# EasyEDA Pro project Rocket PCB Final.epro, board HexaFlight V3 PCB
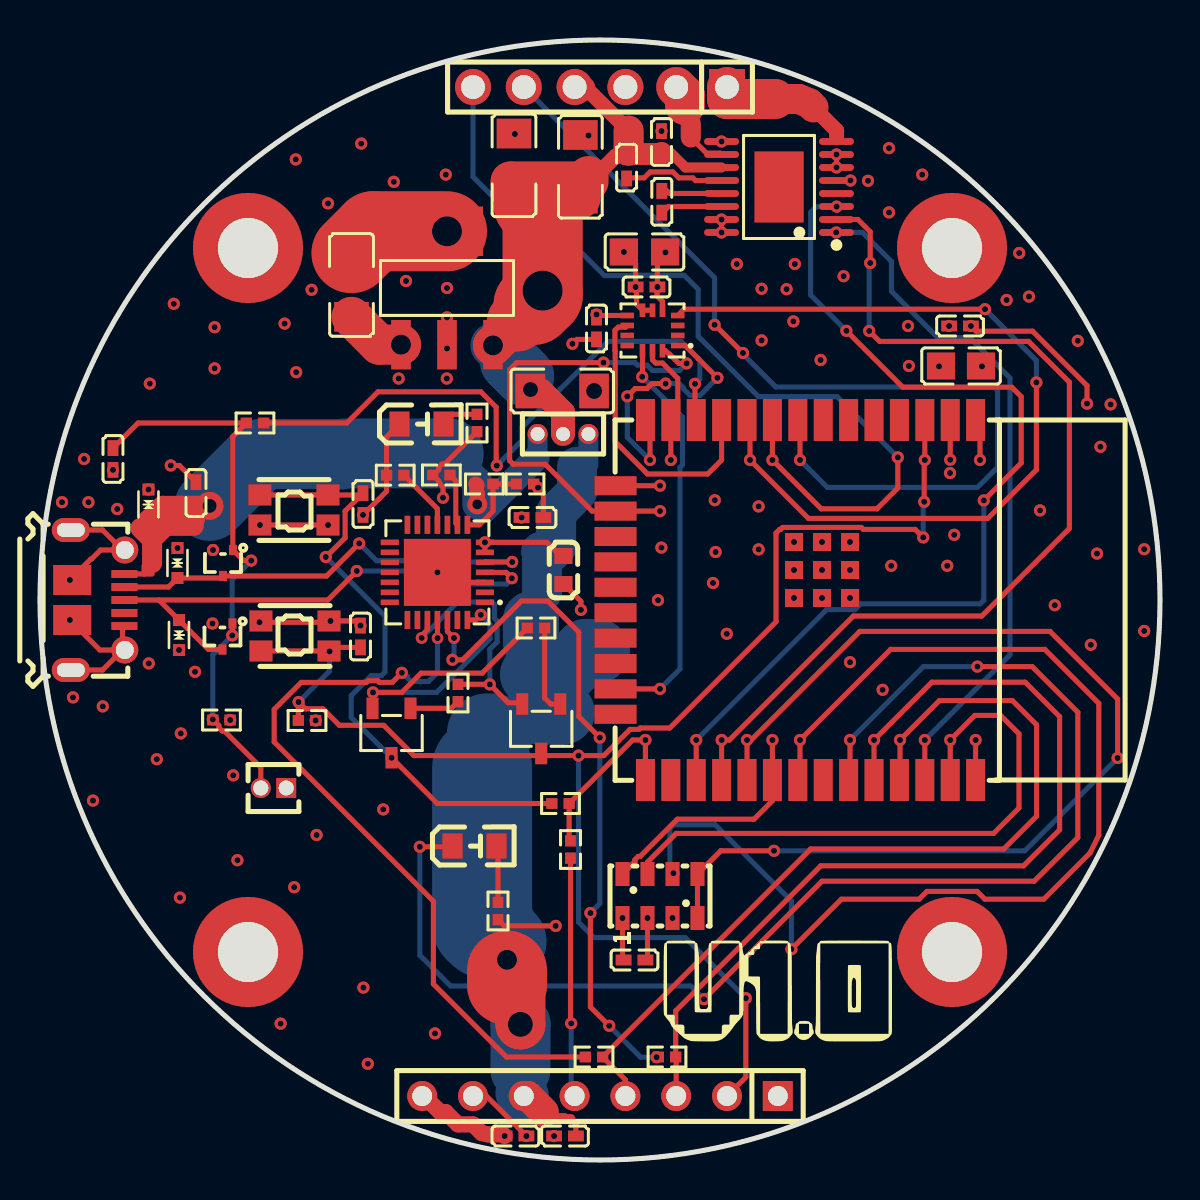
[diagram p1: board, top side]
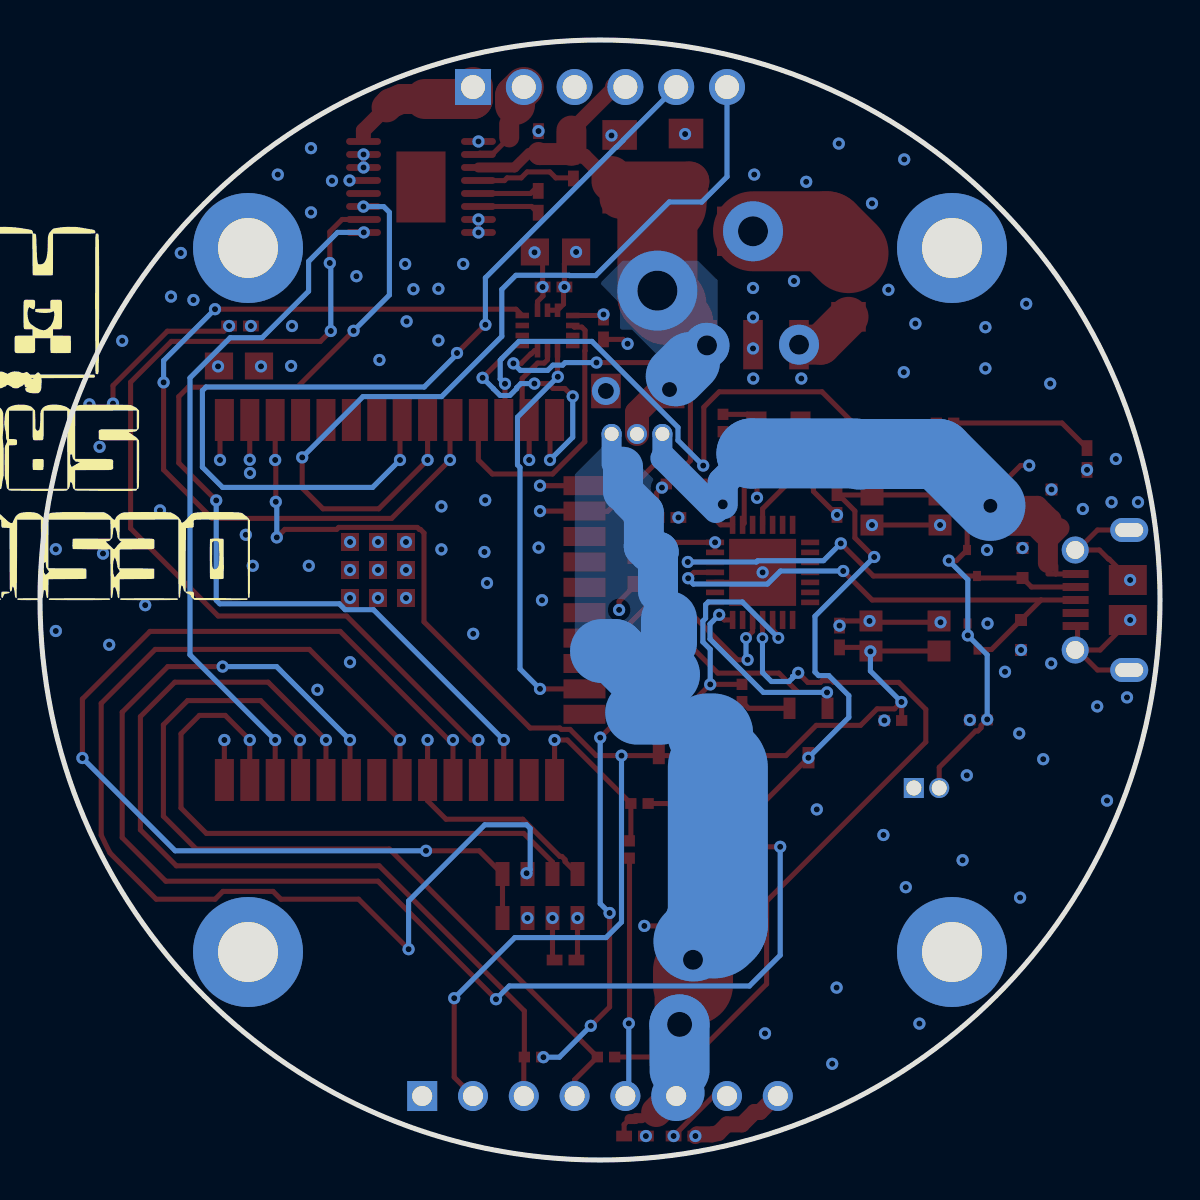
[diagram p2: board, bottom side, seen from below]

Outline 56 x 56 mm; copper layers: Top Layer, Inner1, Inner2, Bottom Layer. Coordinates in mm from the lower left corner of the outline.
Outline path: circle c28,28 r28
Stack: Top Layer 0.035mm Outer layer thickness 1oz / Dielectric1 0.2104mm 7628 RC49% 8.6mil / Inner1 0.0152mm Inner layer thickness / Dielectric2 1.065mm 1.1mm H/HOZ Copper / Inner2 0.0152mm Inner layer thickness / Dielectric3 0.2104mm 7628 RC49% 8.6mil / Bottom Layer 0.035mm Outer layer thickness 1oz

## Design rules (mm)
template: Custom Config
spacing copperThickness1oz (default): track to track 0.102, other pairs 0.152 to 0.3
spacing copperThickness2oz: track to track 0.203, other pairs 0.152 to 0.3
track width copperThickness1oz (default): min 0.1, default 0.254, max 10
track width copperThickness2oz: min 0.203, default 0.254, max 2.54
track width +3V3: min 1, default 1, max 3
track width +5V5 Ext: min 2, default 2, max 3
track width GND: min 1, default 1, max 3
differential pair differentialPair (default): width min 0.127, default 0.254, max 2.54; gap min 0.152, default 0.152
via viaSize (default): diameter min 0.4, default 0.61, max 10; hole min 0.3, default 0.305, max 6.3

## Placement (name value [footprint] x y rotation side)
C1  10uF  [C1206]  26.11 38.45 180 top
C2  10uF  [C1206]  15.57 43.75 90 top
C3  100nF  [C0402]  7.8 33.35 270 top
C4  4.7uF  [C0603]  26.18 29.5 90 top
C5  100nF  [C0402]  24.62 32.12 180 top
C6  100nF  [C0402]  3.65 35.05 90 top
C7  100nF  [C0402]  29.33 49.62 90 top
C8  100nF  [C0402]  23.78 1.2 180 top
C9  100nF  [C0402]  16.02 26.17 270 top
C10  22uF  [C0805#2]  46.05 39.7 180 top
C11  100nF  [C0402]  46 41.7 180 top
C12  100nF  [C0402]  31.07 50.9 270 top
C13  100nF  [C0402]  16.15 32.8 90 top
C14  100nF  [C0402]  26.25 1.2 0 top
C20  10uF  [C1206]  23.7 49.73 270 top
C21  10uF  [C1206]  27.02 49.66 270 top
C23  22nF  [C0402]  31.09 47.91 270 top
C25  100nF  [C0402]  29.72 10 180 top
C26  100nF  [C0402]  30.32 43.65 0 top
D1  LESD5D5.0CT1G  [SOD-523_L1.2-W0.8-LS1.6-BI]  5.42 32.78 270 top
D2  LESD5D5.0CT1G  [SOD-523_L1.2-W0.8-LS1.6-BI]  6.87 29.85 270 top
D3  LESD5D5.0CT1G  [SOD-523_L1.2-W0.8-LS1.6-BI]  6.95 26.25 90 top
H1  Header-Male-2.54_1x6  [HDR-TH_6P-P2.54-V-M-1]  28 53.65 180 top
H3  TJC8-2.54-8A  [HDR-TH_8P-P2.54-V-M-4]  28 3.2 180 top
J3  105017-0001  [MICRO-USB-SMD_105017-0001]  2.89 28 270 top
J4  210-1S-1*3Ppin Gold-plated  [HDR-TH_3P-P1.27-V-M-1]  26.15 36.3 0 top
J5  DZ127R-11-02-25  [HDR-TH_2P-P1.27-V-M]  11.67 18.6 180 top
LED1  0805G (Green)  [LED0805-RD_GREEN]  19.07 36.8 0 top
LED2  FC-2012HRK-620D  [LED0805-RD_RED]  21.72 15.7 0 top
NOREF  -  [Pad_e474]  45.6 10.4 0 top
NOREF#2  -  [Pad_e470]  45.6 45.6 0 top
NOREF#3  -  [Pad_e472]  10.4 45.6 0 top
NOREF#4  -  [Pad_e468]  10.4 10.4 0 top
Q1  2N7002T-7-F  [SOT-523-3_L1.6-W0.8-P1.00-LS1.6-BR]  9.12 26.17 90 top
Q2  SS8050-G  [SOT-23-3_L2.9-W1.6-P1.90-LS2.8-BR]  25.06 21.56 90 top
Q3  2N7002T-7-F  [SOT-523-3_L1.6-W0.8-P1.00-LS1.6-BR]  9.15 29.85 90 top
Q4  SS8050-G  [SOT-23-3_L2.9-W1.6-P1.90-LS2.8-BR]  17.57 21.35 90 top
R1  5.1kΩ  [R0402]  21.85 36.85 270 top
R2  560Ω  [R0402]  22.9 12.45 270 top
R3  1kΩ  [R0402]  20.07 34.25 180 top
R4  0Ω  [R0402]  27.7 5.15 180 top
R5  0Ω  [R0402]  31.35 5.15 180 top
R6  10kΩ  [R0402]  24.8 26.6 0 top
R7  22.1kΩ  [R0402]  22.22 33.8 180 top
R8  10kΩ  [R0402]  17.76 34.24 0 top
R9  1kΩ  [R0402]  10.75 36.85 0 top
R10  10kΩ  [R0402]  20.9 23.35 270 top
R11  10kΩ  [R0402]  9.07 22 180 top
R12  47.5kΩ  [R0402]  24.25 33.8 180 top
R13  10kΩ  [R0402]  13.35 21.97 0 top
R14  22Ω  [R0402]  26.53 15.52 270 top
R15  22Ω  [R0402]  26.03 17.82 180 top
SW3  EVPAA602W  [KEY-TH_4P-L3.5-W4.9-P2.80-LS4.3]  12.75 26.2 180 top
SW4  EVPAA602W  [KEY-TH_4P-L3.5-W4.9-P2.80-LS4.3]  12.7 32.5 0 top
U1  AMS1117-3.3_C347222  [SOT-223-4_L6.5-W3.5-P2.30-LS7.0-BR]  20.35 43.6 270 top
U2  CP2102N-A02-GQFN28R  [QFN-28_L5.0-W5.0-P0.50-TL-EP3.3]  19.87 29.38 180 top
U3  ESP32-WROOM-32E(8MB)  [WIFI-SMD_ESP32-WROOM-32E]  37.78 28 180 top
U9  10nF  [C0402]  27.82 41.58 270 top
U10  2.2uF  [C0805]  30.22 45.4 180 top
U11  MS560702BA03-50  [SENSOR-SMD_MS560702BA03-50]  31 13.2 90 top
U12  ICM-42688-P  [LGA-14_L3.0-W2.5-P0.50-TL]  30.62 41.48 180 top
U13  DRV8874PWPR  [HTSSOP-16_L5.0-W4.4-P0.65-LS6.4-BL-EP]  36.95 48.65 90 top

## Footprints (pads in the part's own frame, mm; a bottom-side part is the same pattern mirrored in y, then rotated)
C0402
  rect 0.79x0.54 smd: 1(-0.545,0) 2(0.545,0)
C0603
  rect 0.8x0.9 smd: 1(-0.7,0) 2(0.7,0)
C0805
  rect 1.41x1.35 smd: 1(-1.03,0) 2(1.03,0)
C0805#2
  rect 1.41x1.35 smd: 1(-1,0) 2(1,0)
C1206
  rect 1.485x1.728 smd: 1(-1.593,0) 2(1.593,0)
HDR-TH_2P-P1.27-V-M
  rect 1x1 hole 0.75: 1(-0.635,0)
  round 1 hole 0.75: 2(0.635,0)
HDR-TH_3P-P1.27-V-M-1
  round 1 hole 0.7: 1(-1.27,0) 2(0,0) 3(1.27,0)
HDR-TH_6P-P2.54-V-M-1
  rect 1.8x1.8 hole 1.2: 1(-6.35,0)
  round 1.8 hole 1.2: 2(-3.81,0) 3(-1.27,0) 4(1.27,0) 5(3.81,0) 6(6.35,0)
HDR-TH_8P-P2.54-V-M-4
  rect 1.5x1.5 hole 1: 1(-8.89,0)
  round 1.5 hole 1: 2(-6.35,0) 3(-3.81,0) 4(-1.27,0) 5(1.27,0) 6(3.81,0) 7(6.35,0) 8(8.89,0)
HTSSOP-16_L5.0-W4.4-P0.65-LS6.4-BL-EP
  oval 0.343x1.746 smd: 1(-2.275,-2.873) 2(-1.625,-2.873) 3(-0.975,-2.873) 4(-0.325,-2.873) 5(0.325,-2.873) 6(0.975,-2.873) 7(1.625,-2.873) 8(2.275,-2.873) 9(2.275,2.873) 10(1.625,2.873) 11(0.975,2.873) 12(0.325,2.873) 13(-0.325,2.873) 14(-0.975,2.873) 15(-1.625,2.873) 16(-2.275,2.873)
  rect 3.55x2.46 smd: 17(0,0)
KEY-TH_4P-L3.5-W4.9-P2.80-LS4.3
  rect 1.15x1.05 smd: 1(-1.702,0.751) 2(1.7,0.75) 3(-1.702,-0.751) 4(1.702,-0.751)
LED0805-RD_GREEN
  rect 1x1.25 smd: 1(-1.1,0) 2(1.1,0)
LED0805-RD_RED
  rect 1x1.25 smd: 1(-1.1,0) 2(1.1,0)
LGA-14_L3.0-W2.5-P0.50-TL
  rect 0.675x0.28 smd: 1(-1.262,0.75) 2(-1.262,0.25) 3(-1.262,-0.25) 4(-1.262,-0.75) 8(1.262,-0.75) 9(1.262,-0.25) 10(1.262,0.25) 11(1.262,0.75)
  rect 0.28x0.675 smd: 5(-0.5,-1.012) 6(0,-1.012) 7(0.5,-1.012) 12(0.5,1.012) 13(0,1.012) 14(-0.5,1.012)
MICRO-USB-SMD_105017-0001
  rect 0.4x1.3 smd: 1(-1.3,1.33) 2(-0.65,1.33) 3(0,1.33) 4(0.65,1.33) 5(1.3,1.33)
  round 1.35 hole 0.9: 6(-2.5,1.35) 7(2.5,1.35)
  oval 1.2x1.9 hole 0.7x1.4: 8(3.5,-1.35) 9(-3.5,-1.35)
  rect 1.5x1.9 smd: 10(-1,-1.28) 10(1,-1.28)
Pad_e468
  round 5.5 hole 3: 1(0,0)
Pad_e470
  round 5.5 hole 3: 1(0,0)
Pad_e472
  round 5.5 hole 3: 1(0,0)
Pad_e474
  round 5.5 hole 3: 1(0,0)
QFN-28_L5.0-W5.0-P0.50-TL-EP3.3
  rect 0.905x0.28 smd: 1(-2.377,1.5) 2(-2.377,1) 3(-2.377,0.5) 4(-2.377,0) 5(-2.377,-0.5) 6(-2.377,-1) 7(-2.377,-1.5) 15(2.377,-1.5) 16(2.377,-1) 17(2.377,-0.5) 18(2.377,0) 19(2.377,0.5) 20(2.377,1) 21(2.377,1.5)
  rect 0.28x0.905 smd: 8(-1.5,-2.377) 9(-1,-2.377) 10(-0.5,-2.377) 11(0,-2.377) 12(0.5,-2.377) 13(1,-2.377) 14(1.5,-2.377) 22(1.5,2.377) 23(1,2.377) 24(0.5,2.377) 25(0,2.377) 26(-0.5,2.377) 27(-1,2.377) 28(-1.5,2.377)
  rect 3.35x3.35 smd: 29(0,0)
R0402
  rect 0.566x0.54 smd: 1(-0.433,0) 2(0.433,0)
SENSOR-SMD_MS560702BA03-50
  rect 1.2x0.7 smd: 1(-1.1,1.875) 2(-1.1,0.625) 3(-1.1,-0.625) 4(-1.1,-1.875) 5(1.1,-1.875) 6(1.1,-0.625) 7(1.1,0.625) 8(1.1,1.875)
SOD-523_L1.2-W0.8-LS1.6-BI
  rect 0.6x0.6 smd: 1(-0.75,0) 2(0.75,0)
SOT-23-3_L2.9-W1.6-P1.90-LS2.8-BR
  rect 1.07x0.6 smd: 1(1.235,-0.95) 2(1.235,0.95) 3(-1.235,0)
SOT-223-4_L6.5-W3.5-P2.30-LS7.0-BR
  rect 2.47x0.98 smd: 1(2.835,-2.3) 2(2.835,0) 3(2.835,2.3)
  rect 2.47x3.6 smd: 4(-2.835,0)
SOT-523-3_L1.6-W0.8-P1.00-LS1.6-BR
  rect 0.51x0.4 smd: 1(0.65,-0.5) 2(0.65,0.5) 3(-0.65,0)
WIFI-SMD_ESP32-WROOM-32E
  rect 0.95x2.1 smd: 1(-9.002,-9) 2(-7.732,-9) 3(-6.463,-9) 4(-5.192,-9) 5(-3.922,-9) 6(-2.652,-9) 7(-1.383,-9) 8(-0.113,-9) 9(1.157,-9) 10(2.428,-9) 11(3.697,-9) 12(4.968,-9) 13(6.237,-9) 14(7.508,-9) 25(7.508,9) 26(6.237,9) 27(4.968,9) 28(3.697,9) 29(2.428,9) 30(1.157,9) 31(-0.113,9) 32(-1.383,9) 33(-2.652,9) 34(-3.922,9) 35(-5.192,9) 36(-6.463,9) 37(-7.732,9) 38(-9.002,9)
  rect 2.1x0.95 smd: 15(9.002,-5.715) 16(9.002,-4.445) 17(9.002,-3.175) 18(9.002,-1.905) 19(9.002,-0.635) 20(9.002,0.635) 21(9.002,1.905) 22(9.002,3.175) 23(9.002,4.445) 24(9.002,5.715)
  rect 0.9x0.9 smd: 39(-2.721,-0.1) 39(-2.721,-1.5) 39(-2.721,-2.9) 39(-1.321,-0.1) 39(-1.321,-1.5) 39(-1.321,-2.9) 39(0.079,-0.1) 39(0.079,-1.5) 39(0.079,-2.9)

## Nets
As in the schematic.

Pads without a net: J3 4; NOREF 1; NOREF#2 1; NOREF#3 1; NOREF#4 1; U2 1 2 10 12 13 14 15 16 17 18 19 20 21 22 23 27; U3 4 5 6 7 17 18 19 20 21 22 24 26 32; U12 2 3 10 11; U13 4

## Via types
v1: diameter 2, hole 1, Top Layer to Bottom Layer, 3 vias
v2: diameter 4, hole 2, Top Layer to Bottom Layer, 1 via
v3: diameter 1.5, hole 0.75, Top Layer to Bottom Layer, 1 via
v4: diameter 0.61, hole 0.305, Top Layer to Bottom Layer, 212 vias
v5: diameter 1.4, hole 0.8, Top Layer to Bottom Layer, 1 via
v6: diameter 3, hole 1.5, Top Layer to Bottom Layer, 1 via
v7: diameter 1, hole 0.5, Top Layer to Bottom Layer, 1 via
v8: diameter 1.4, hole 0.7, Top Layer to Bottom Layer, 1 via
v9: diameter 2.5, hole 1.25, Top Layer to Bottom Layer, 1 via
v10: diameter 0.59, hole 0.305, Top Layer to Bottom Layer, 2 vias
v11: diameter 0.58, hole 0.305, Top Layer to Bottom Layer, 1 via

## Routing (per net, layer and track width the routed paths; a pad name or vN(x,y) marks a point on that pad's centre or on a via; arc(x,y) is an arc through that point)
+3V3: length 31.3
  Top Layer w0.254: 26.18,30.05 25.34,30.88 v4(22.25,30.88) U2.6 ; U12.8 27.88,42.23 v4(27.82,42.28) ; U3.2 v4(45.51,35.01) 45.5,35 ; v4(25.78,11.7) 23.21,11.7 R2.2 ; C25.2 29.12,10.05 v4(29.12,12.1) ; v4(31.27,45.38) 30.87,44.98 v4(30.87,43.65) 30.85,43.63 30.85,43.2 31.12,42.93 U12.5 ; v4(20.15,33.11) 20.15,33.66 19.94,33.86 19.94,33.95 R3.2 19.68,34.25 19.94,34.51 19.94,34.64 20.1,34.8 20.23,34.8 R1.2
  Top Layer w0.8: v4(23.23,1.2) 23.15,1.28 22.41,1.28 arc(22.24,1.31) 22.08,1.35 21.65,1.78 20.9,1.78 20.28,2.4 20,2.4 19.2,3.2 H3.8
  Top Layer w4: C2.2 16.67,46.44 v6(20.35,46.44)
  vias: v4(13.58,43.51) v4(13.78,21.97) v4(14.4,47.83) v4(17.69,48.91) v4(18.3,43.95) v4(20.29,49.27) v4(20.35,43.6) v4(20.35,42.13) v4(20.35,40.58) v4(20.34,39.07) v4(24.08,32.12) v4(40.52,48.98) v4(41.4,48.96) v4(43.4,41.7) v4(43.45,39.7) v4(44.95,39.68) v4(45.46,41.7) v4(45.5,34.35)
+5V: length 31.7
  Top Layer w0.5: 31.54,50.36 32.27,49.63 34.08,49.63
  Top Layer w0.75: 27.79,49.21 28.78,50.2 29.43,50.2 ; H1.4 27.25,53.65 ; 29.25,51.65 27.43,53.47 27.25,53.47
  Top Layer w1: 27.25,53.65 27.25,53.47 ; 29.25,51.47 29.43,51.47
  Top Layer w1.1: 29.43,50.46 29.59,50.3 31.02,50.3 31.07,50.35
  Top Layer w1.2: v3(24.53,38.52) 24.6,38.45 25.07,38.45 26.15,37.38 J4.2
  Top Layer w1.5: 29.43,51.47 29.43,50.46
  Top Layer w2: 27.15,48.92 27.02,48.79 C21.2 ; 27.15,48.92 27.43,48.92 ; 27.15,48.92 27.43,49.2 ; 27.15,48.92 23.53,48.92 24.08,48.38 ; v1(22.65,40.73) 23.84,41.92
  Top Layer w3: 23.84,41.92 24.67,42.75 ; 24.67,47.78 24.08,48.38
  Top Layer w4: 24.67,47.78 25.13,47.33 25.13,43.21 24.67,42.75
  Bottom Layer w2.25: 23.5,39.9 22.67,40.73 v1(22.65,40.73)
  Bottom Layer w3: 24.21,39.19 23.5,39.9
  vias: v2(25.13,43.47)
+5V_EXT: length 30.9
  Top Layer w0.254: 26.52,2.05 26.79,1.78 C14.2
  Top Layer w0.5: 25.91,2.09 26.21,2.09 26.25,2.05 26.52,2.05
  Top Layer w1.5: H3.6 24.39,3.2 25.19,2.4
  Top Layer w2.5: v9(24.02,6.78) 24.02,8.09 ; 23.62,9.74 v1(23.35,10.01)
  Top Layer w4: 23.35,8.75 23.35,9.47
  Bottom Layer w1: 27.42,34.78 J4.3
  Bottom Layer w2: 26.5,33.06 25.81,32.37 25.81,30.67 25.55,30.41 25.07,30.41 25.1,30.38 25.1,28.41 ; 26.85,34.66 26.85,33.41
  Bottom Layer w2.5: 24.02,3.37 H3.6
  Bottom Layer w2.8: 24.55,25.86 24.55,27.04
  Bottom Layer w3: 24.02,4.5 24.03,6.77 v9(24.02,6.78)
  Bottom Layer w3.2: 24.6,24.27 24.66,24.27 24.78,24.15 ; 27.9,25.45 27.29,25.45 26.03,24.19 ; 24.93,22.37 26.14,22.37
  Bottom Layer w4: 22.31,11.58 22.68,11.58 23.33,10.93 ; 22.35,21.33 arc(22.49,21.32) 22.63,21.33
  Bottom Layer w5: 22.31,11.58 22.11,11.78 22.11,19.62
+5V_VBUS: length 33.4
  Top Layer w0.254: 5.21,29.3 5.61,29.3 ; 5.21,29.3 J3.1 ; 5.21,29.3 5.21,29.72
  Top Layer w0.75: R7.2 21.84,33.74 21.84,33.31 21.86,33.29 v7(21.86,32.78)
  Top Layer w1: 6.23,31.71 6.29,31.71 ; 6.29,31.71 7.69,31.71 ; 6.29,31.71 5.81,31.23 ; 5.61,29.85 5.61,31.01 5.02,31.59 ; v8(8.48,32.71) 6.13,32.71 5.45,32.03 5.42,32.03 ; 6.54,31.96 6.63,32.05 7.75,32.05
  Bottom Layer w1: J4.1 24.88,35.09
  Bottom Layer w1.2: 24.88,35.09 24.79,35.09
  Bottom Layer w1.25: 9.54,32.77 8.59,32.77
  Bottom Layer w1.3: 24.79,35.09 22.2,32.5
  Bottom Layer w1.5: v7(21.86,32.78) 21.86,33.89 20.43,35.32
  Bottom Layer w3.5: 20.43,35.32 20.42,35.33 15.26,35.33 ; 15.01,35.27 14.98,35.3 11.07,35.3 v8(8.48,32.71)
GND: length 64.5
  Top Layer w0.254: v4(16.02,26.72) 15.79,26.95 v4(14.52,26.95) ; v4(47,35) 47,36.78 U3.1 ; v4(11,31.75) 14.4,31.75 ; v4(29.19,45.4) 29.78,44.82 v4(29.78,43.65) 29.82,43.61 29.82,42.79 U12.7 30.63,42.49 ; v4(1.49,27) 2.99,25.5 4.12,25.5 ; v4(27.04,27.5) 27.04,27.93 C4.1 ; v4(1.49,29) 2.54,30.05 2.58,30.05 3.03,30.5 4.12,30.5 3.12,31.5 1.42,31.5 ; v4(10.97,26.89) 14.39,26.89 SW3.3 ; v4(52.35,37.82) 52.35,38.72 49.63,41.44 46.81,41.44 v4(46.55,41.7) ; v4(34.08,47.03) v4(34.08,46.38) ; C5.1 25.17,33.35 v4(24.9,33.62) ; v4(26.62,40.81) 26.84,41.03 U9.2 ; 22.25,28.88 20.37,28.88 v4(19.87,29.38) ; C3.1 6.97,34.73 v4(6.54,34.73) ; C25.1 30.38,10.1 v4(30.38,12.1) ; v4(24.32,1.2) 22.32,3.2 H3.7 ; v4(16.15,32.25) 17.33,33.43 R8.1 17.33,36.15 LED1.1 ; 4.1,26.7 4.12,26.68 4.12,25.5 ; 1.42,24.5 3.12,24.5 4.12,25.5 ; v4(39.82,50.28) v4(39.82,49.63) ; U3.15 v4(31,33.72) ; U3.38 v4(46.78,21)
  Top Layer w2: v1(18.05,40.77) 16.97,40.77 C2.1
  vias: v4(1.1,32.89) v4(1.65,23.13) v4(2.21,35.05) v4(2.42,32.89) v4(2.65,17.97) v4(3.14,22.68) v4(3.65,34.51) v4(3.86,32.55) v4(5.42,33.53) v4(5.44,24.83) v4(5.49,38.82) v4(5.84,20.04) v4(6.69,42.81) v4(6.87,30.6) v4(6.95,25.5) v4(7.04,21.33) v4(7,13.12) v4(7.75,24.41) v4(8.65,30.5) v4(8.62,26.83) v4(8.73,41.64) v4(8.73,39.58) v4(9.51,22) v4(9.66,19.23) v4(9.87,14.99) v4(12.03,6.82) v4(12.23,41.82) v4(12.71,13.64) v4(12.79,50.03) v4(12.81,39.39) v4(13.83,16.25) v4(14.4,31.75) v4(16.06,50.82) v4(16.17,8.62) v4(16.39,4.81) v4(17.16,17.53) v4(17.94,39.07) v4(19.75,6.33) v4(23.75,51.3) v4(25.71,1.2) v4(27.43,51.23) v4(30.9,27.99) v4(31.07,51.45) v4(31.07,30.62) v4(31.62,12.1) v4(33.74,32.99) v4(33.65,28.85) v4(33.78,30.4) v4(34.08,50.93) v4(34.34,26.31) v4(34.84,44.8) v4(35.93,32.68) v4(35.93,30.53) v4(36.08,43.56) v4(36.08,40.98) v4(37.33,43.54) v4(37.74,44.8) v4(37.67,41.93) v4(37.7,30.9) v4(37.7,29.5) v4(37.7,28.1) v4(39.03,40) v4(39.1,30.9) v4(39.1,29.5) v4(39.1,28.1) v4(40.18,44.19) v4(40.5,30.9) v4(40.5,29.5) v4(40.5,28.1) v4(40.5,24.89) v4(42.13,23.51) v4(42.45,50.59) v4(42.45,47.38) v4(42.56,29.71) v4(44.11,49.27) v4(45.36,29.71) v4(45.71,31.26) v4(47.1,39.68) v4(48.33,43) v4(48.96,45.35) v4(49.45,43.17) v4(50,32.48) v4(50.74,27.74) v4(51.89,40.96) v4(52.54,25.76) v4(52.85,30.32) v4(53.02,35.66) v4(53.53,37.78) v4(55.21,30.54) v4(55.21,26.45) v5(27.71,38.45)
DTR: length 19
  Top Layer w0.254: U2.28 21.78,27 v4(22.04,27.26) ; Q4.2 16.65,22.61 v4(16.65,23.38) 18.09,23.38 19.05,24.34 22.11,24.34 R6.1
  Bottom Layer w0.254: v4(16.65,23.38) 19.83,23.38 22.5,26.05 22.5,26.8 v4(22.04,27.26)
EN: length 78.5
  Top Layer w0.254: v4(44.16,31.13) 43.76,31.53 41.17,31.53 41.07,31.63 37.13,31.63 37.04,31.53 36.98,31.53 36.8,31.35 36.8,26.91 31.49,21.6 30.01,21.6 29.94,21.53 29.5,21.53 28.19,20.22 v4(26.93,20.22) 18.7,20.22 17.19,21.73 14.97,21.73 14.15,22.56 13.27,22.56 v4(12.93,22.9) 12.92,22.89 R13.1 ; U3.3 v4(44.24,35) 44.21,34.97 v4(44.21,32.91) ; C9.2 14.63,25.63 SW3.1 ; 11.05,25.45 14.45,25.45 ; H3.2 35.29,4.14 v4(35.29,8.09)
  Bottom Layer w0.254: v4(44.16,31.13) 44.16,32.86 v4(44.21,32.91) ; v4(14.48,25.43) 14.48,24.45 v4(12.93,22.9) ; v4(26.93,20.22) 26.93,11.89 27.7,11.12 32.26,11.12 v4(35.29,8.09)
ENABLE: length 34.4
  Top Layer w0.254: U3.36 v4(44.24,21)
  Bottom Layer w0.254: v4(44.24,21) 48.5,25.26 48.5,39.11 46.49,41.12 44.89,41.12 42.57,43.44 42.57,44.93 41.12,46.38 v4(39.81,46.38)
ENCA: length 48.1
  Top Layer w0.254: v4(35.15,40.35) 33.74,41.76 v4(33.73,41.76) ; U3.8 38,36.89 v4(38,35)
  Bottom Layer w0.254: v4(38,35) 39.37,33.63 46.87,33.63 47.88,34.64 47.88,38.47 47.7,38.65 36.79,38.65 35.21,40.23 35.21,40.29 v4(35.15,40.35) ; H1.5 26.84,51 26.84,50.98 27.18,50.64 27.2,50.64 33.73,44.11 v4(33.73,41.76)
ENCB: length 44.2
  Top Layer w0.254: U3.9 v4(36.62,35) 39.06,32.56 41.85,32.56 42.89,33.6 v4(42.89,35.13)
  Bottom Layer w0.254: v4(42.89,35.13) 39.85,38.17 35.92,38.17 32.91,41.18 32.91,43.53 32.21,44.23 29.54,44.23 29.52,44.22 28.22,44.22 24.54,47.9 22.91,47.9 21.65,49.16 H1.6
HSPICLK: length 6.3
  Top Layer w0.254: v4(31.54,35) U3.13 31.89,37.35 31.89,39.08 31.12,39.85 30.79,39.85 30.62,40.01 30.63,40.46
HSPICS: length 20.4
  Top Layer w0.254: U3.23 v4(31,23.56) ; U12.12 30.12,39.34 30.11,39.33 v4(30.11,39.16)
  Bottom Layer w0.254: v4(30.11,39.16) 32.13,37.14 32.13,34.76 32,34.63 32,24.56 v4(31,23.56)
HSPIMISO: length 13.8
  Top Layer w0.254: U12.1 32.26,40.73 32.91,40.07 32.91,40.07 v4(33.87,39.11) ; U3.14 30.5,36.77 v4(30.5,35) ; v4(31.28,38.82) 30.6,38.82 30.35,38.58 29.76,38.58 v4(29.36,38.18)
  Bottom Layer w0.254: v4(33.87,39.11) 33.33,38.57 33.33,38.57 32.99,38.23 32.51,38.23 32.17,38.57 32.17,38.61 31.96,38.82 v4(31.28,38.82) ; v4(29.36,38.18) 29.36,36.14 v4(30.5,35)
HSPIMOSI: length 23.9
  Top Layer w0.254: v4(32.33,39.83) 31.94,39.83 31.46,40.31 31.43,40.31 31.28,40.46 U12.14 ; v4(28.18,39.87) 23.84,39.87 23.5,39.53 23.5,38 23.48,37.98 23.48,34.97 23.66,34.79 25.26,34.79 27.6,32.44 U3.16 v4(31,32.44)
  Bottom Layer w0.254: v4(28.18,39.87) 29.74,39.87 29.87,39.74 30.35,39.74 30.62,39.48 31.98,39.48 v4(32.33,39.83)
IO0: length 9
  Top Layer w0.254: 26.53,15.96 26.46,16.02 R15.1 29.63,21 v4(30.27,21) U3.25
IO0_BTN: length 31.1
  Top Layer w0.254: v4(17.58,20.11) 19.87,17.82 R15.2 ; 14.4,33.25 16.06,33.25 ; 16.06,33.25 16.15,33.35 ; 16.06,33.25 15.26,32.45 15.26,31.11 14.3,30.15 v4(14.29,30.15) ; 11,33.25 14.4,33.25
  Bottom Layer w0.254: v4(17.58,20.11) 15.56,22.13 15.56,23.22 16.56,24.22 17.07,24.22 17.25,24.4 17.25,27.19 v4(14.29,30.15)
IO0_CON: length 12
  Top Layer w0.254: R14.2 26.53,6.87 v4(26.56,6.83)
  Bottom Layer w0.254: H3.5 26.56,3.37 v4(26.56,6.83)
IO21: length 66.4
  Top Layer w0.254: U3.33 40.5,19.07 v4(40.5,21) ; v4(18.99,15.66) 20.59,15.66 LED2.1 ; v4(33.2,8.04) 39.1,13.94 49.71,13.94 51.89,16.12 51.89,22.39 49.61,24.67 v4(46.87,24.67)
  Bottom Layer w0.254: v4(40.5,21) 44.17,24.67 v4(46.87,24.67) ; v4(33.2,8.04) 32.54,8.7 20.53,8.7 18.99,10.24 v4(18.99,15.66)
IO25: length 43.2
  Top Layer w0.254: U3.10 35.5,36.85 v4(35.5,35) 38.42,32.08 47.39,32.08 49.82,34.51 v4(49.82,38.88) ; U12.4 32.2,42.54 v4(47.25,42.54)
  Bottom Layer w0.254: v4(47.25,42.54) 49.82,39.97 v4(49.82,38.88)
IO26: length 14.6
  Top Layer w0.254: U3.11 34.08,35 33.38,34.3 30.38,34.3 28.76,35.91 28.76,40.46 28.75,40.47 28.75,41.48 28.91,41.64 29.28,41.64 U12.9
IO27: length 32.1
  Top Layer w0.254: U3.12 32.75,37.06 v4(32.75,38.81) ; v4(22.84,34.72) 22.84,34.79 22.81,34.82 22.81,37.64 22.04,38.41 16.9,38.41 15.34,36.85 R9.2
  Bottom Layer w0.254: v4(22.84,34.72) 24.1,35.98 24.1,36.63 28.4,40.93 32.06,40.93 32.91,40.07 32.91,40.07 32.99,39.99 32.99,39.05 v4(32.75,38.81)
NSLEEP: length 48.4
  Top Layer w0.254: v4(39.83,47.67) U13.3 ; v4(40.32,41.46) 43.14,38.64 48.59,38.64 49.06,38.17 49.06,34.85 v4(47.19,32.98) ; U3.27 v4(32.81,21)
  Bottom Layer w0.254: v4(47.19,32.98) 47.19,27.99 47.01,27.81 41.04,27.81 40.74,27.52 39.33,27.52 v4(32.81,21) ; v4(40.32,41.46) 38.53,43.25 38.53,47.39 38.81,47.67 v4(39.83,47.67)
OUT1: length 7
  Top Layer w0.75: 38.67,52.63 39.83,51.47 39.83,51.15
  Top Layer w1.5: 36.75,53.05 37.94,53.05 arc(38.21,52.94) 38.47,52.83 38.67,52.63
  Top Layer w2: H1.1 34.35,53.06 34.36,53.05 36.75,53.05
OUT2: length 3.6
  Top Layer w0.254: 34.08,50.28 34.01,50.34 33.32,50.34 32.54,51.12
  Top Layer w1: 32.54,51.13 32.54,51.81
  Top Layer w2: H1.2 32.25,53.21 32.25,52.75
PH: length 49.1
  Top Layer w0.254: v4(41.51,44.85) 41.51,46.41 40.89,47.03 U13.2 ; U3.28 v4(34.08,21) 34.47,21 40.67,27.2 47.09,27.2 51.47,31.58 51.47,38.89 49.43,40.93 41.98,40.93 v4(41.46,41.45)
  Bottom Layer w0.254: v4(41.46,41.45) 41.46,44.8 v4(41.51,44.85)
RTS: length 13.3
  Top Layer w0.254: v10(19.08,26.1) 19.08,26.23 19.37,26.52 U2.24 ; 20.9,23.78 22.49,23.78 v4(22.49,23.78) 23.41,22.86 24.05,22.86 Q2.2
  Bottom Layer w0.254: v4(22.49,23.78) 22.49,25.54 22.86,25.9 22.86,26.95 22.72,27.08 22.72,27.77 22.59,27.9 20.88,27.9 v10(19.08,26.1)
RXD: length 38.2
  Top Layer w0.254: v11(19.88,26.09) 19.88,26.4 19.87,26.4 19.87,27 U2.25 ; R4.2 23.32,5.15 19.67,8.8 19.67,12.94 11.71,20.9 11.71,22.53 13.06,23.88 16.32,23.88 16.41,23.96 16.89,23.96 16.98,23.88 17.61,23.88 v4(18.09,24.36)
  Bottom Layer w0.254: v11(19.88,26.09) 19.88,24.38 19.43,23.92 18.55,23.92 18.37,24.1 18.37,24.18 18.27,24.18 v4(18.09,24.36)
RXD0: length 46.1
  Top Layer w0.254: U3.34 v4(41.7,21) 44.59,23.89 49.26,23.89 50.98,22.17 50.98,16.51 49.18,14.71 39.04,14.71 31.78,7.45 R5.1 31.81,5.12 H3.3
TXD: length 34.1
  Top Layer w0.254: v4(27.99,21.12) 26.94,22.17 26.94,26.4 25.39,27.95 24.07,27.95 21.13,25.01 v4(20.62,25.01) ; v4(28.46,6.71) 27.52,7.65 v4(27.52,12.35) ; U2.26 20.37,26.43 v10(20.7,26.1)
  Bottom Layer w0.254: v10(20.7,26.1) 20.7,25.09 v4(20.62,25.01) ; v4(27.52,12.35) 27.99,12.82 v4(27.99,21.12) ; v4(28.46,6.71) 30.03,5.14 v4(30.83,5.14)
TXD0: length 43.8
  Top Layer w0.254: U3.35 43,19.03 v4(43,21) 44.97,22.97 48.62,22.97 49.83,21.76 49.83,17.19 48.19,15.55 38.53,15.55 R4.1 29.27,4.01 H3.4
USB_DN: length 22.2
  Top Layer w0.254: 4.1,28.65 6.42,28.65 D2.2 9.05,29.1 Q3.3 14.33,29.2 v4(15.96,30.83) ; v4(23.61,29.9) 22.27,29.9 22.25,29.88
  Bottom Layer w0.254: v4(15.96,30.83) 16.82,29.97 20.11,29.97 20.18,29.9 v4(23.61,29.9)
USB_DP: length 26.2
  Top Layer w0.254: U2.4 23.3,29.38 23.37,29.32 23.37,29.31 v4(23.59,29.09) ; 5.95,28 14.39,28 v4(15.84,29.45) ; 5.95,28 D3.2 8.42,25.53 9.11,25.53 ; 5.95,28 4.1,28
  Bottom Layer w0.254: v4(23.59,29.09) 23.59,29.05 23.33,28.8 19.63,28.8 18.98,29.45 v4(15.84,29.45)
VSPICLK: length 12.1
  Top Layer w0.254: U11.8 29.75,14.92 29.75,15.01 29.91,15.18 30,15.18 31.87,17.04 35.7,17.04 36.62,17.96 U3.30 v4(36.62,21)
VSPICS: length 52.7
  Top Layer w0.254: U3.29 v4(35.35,21) 35.56,21 40.99,26.43 50.5,26.43 53.88,23.05 v4(53.88,20.1) ; U11.4 U11.5 34.04,15.46 v4(36.7,15.46)
  Bottom Layer w0.254: v4(36.7,15.46) 49.24,15.46 v4(53.88,20.1)
VSPIMISO: length 57.3
  Top Layer w0.254: v4(37.57,10.54) 40.07,13.04 43.96,13.04 44.35,13.43 46.85,13.43 47.24,13.04 50.19,13.04 52.5,15.35 arc(52.72,15.79) 52.94,16.24 52.94,22.83 50.24,25.53 42.53,25.53 v4(38,21) 38,19.11 U3.31
  Bottom Layer w0.254: v4(37.57,10.54) 37.57,12.95 33.76,16.76 31.67,16.76 31.49,16.58 31.49,14.52 v4(31.67,14.34)
VSPIMOSI: length 30.3
  Top Layer w0.254: U11.7 30.38,14.89 31.81,16.33 47.68,16.33 48.95,17.6 48.95,21.31 48.03,22.23 46.74,22.23 v4(45.51,21) U3.37
$1N42: length 2.6
  Top Layer w0.254: U2.9 20.79,31.84 20.79,33.96 R3.1
$1N44: length 3.2
  Top Layer w0.254: U2.11 19.87,32.56 R8.2
$1N46: length 4.1
  Top Layer w0.254: R12.2 R7.1 22.65,32.44 21.97,31.76 U2.8
$1N68: length 4.4
  Top Layer w0.254: Q2.1 25.54,22.8 25.23,23.1 R6.2
$1N69: length 2.5
  Top Layer w0.254: R10.2 20.57,22.58 Q4.1
$1N79: length 1.9
  Top Layer w0.254: LED1.2 20.66,37.28 R1.1
$1N93: length 2.8
  Top Layer w0.254: LED2.2 22.9,15.62 R2.1
$1N96: length 28.8
  Top Layer w0.254: v4(9.61,26.23) 9.62,26.24 Q1.1 ; C6.2 4.9,36.85 R9.1 9.64,36.17 9.64,30.51 Q3.1 10.18,29.97 v4(10.56,29.97) ; J5.2 11.04,19.63 9.22,21.45 9.11,21.45 8.94,21.61 8.94,21.72 v4(8.64,22.03)
  Bottom Layer w0.254: v4(8.64,22.03) 8.64,25.26 v4(9.61,26.23) 9.61,29.02 v4(10.56,29.97)
$1N109: length 5
  Top Layer w0.254: 29.43,49.11 30.21,49.11 30.51,49.41 31.64,49.41 31.94,49.11 32.64,49.11 32.78,48.97 34.07,48.97 34.08,48.98
$1N114: length 3.2
  Top Layer w0.254: 31.07,48.73 31.47,48.33 34.08,48.33
$1N115: length 3.1
  Top Layer w0.254: 34.08,47.68 31.43,47.68 31.07,47.33

## Copper pours and planes (outline as drawn; the poured copper is in the pictures)
+3V3 on Inner1: 0.26,55.74 55.75,55.74 55.75,0.25 0.26,0.25
+5V on Bottom Layer: 22.11,41.63 22.11,43.98 23.1,44.97 26.86,44.97 28,43.83 27,42.83 27,41.55 26.97,41.52 26.4,41.52 25,40.12 23.62,40.12
+5V_EXT on Bottom Layer: 26.97,35.69 27.85,35.69 29.26,34.28 29.26,25.21 25.36,25.21 25.23,25.34 25.23,33.95
GND on Inner2: 0.26,55.74 55.74,55.74 55.74,0.25 0.26,0.25

Small or netless copper shapes (teardrops, artwork), in the pictures only: 7 on Inner1, 26 on Inner2
